# Altium schematic sheet BLE.SchDoc
size A4
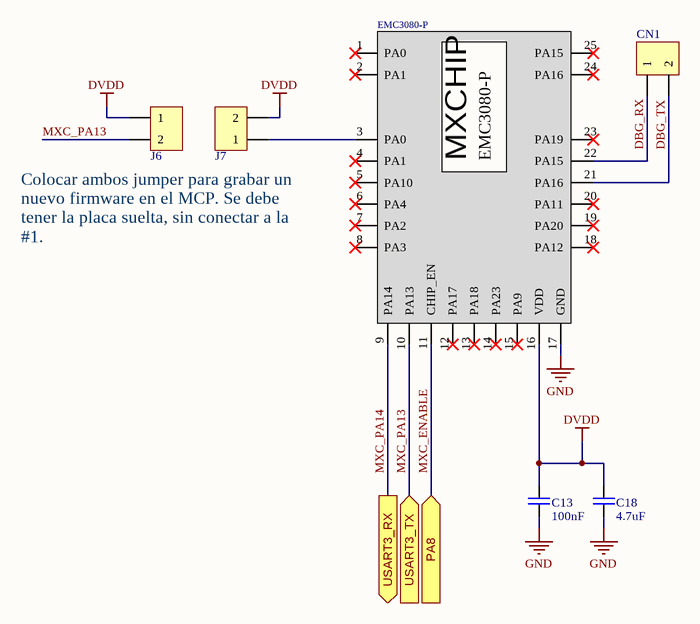
[diagram p0: BLE.SchDoc]

## Parts
C13  100nF  [CAP_SM0805_YAGEOCC2_N]
C18  4.7uF  [CAP_SM0805_YAGEOCC2_N]
CN1  Usar Equivalente  [HEADER PIN 1X2]  (value not drawn)
EMC3080-P  EMC3080-P  [EMC3080-P]  (value not drawn)
J6  Usar Equivalente  [HEADER PIN 1X2]  (value not drawn)
J7  Usar Equivalente  [HEADER PIN 1X2]  (value not drawn)

## Ports
PA8 (in), USART3_RX (out), USART3_TX (in)

## Nets
DVDD: C13.1 C18.1 EMC3080-P.16(VDD) J6.1 J7.2
GND: C13.2 C18.2 EMC3080-P.17(GND)
DBG_RX: CN1.1 EMC3080-P.22(PA15)
DBG_TX: CN1.2 EMC3080-P.21(PA16)
MXC_ENABLE: EMC3080-P.11(CHIP_EN) ; port PA8
MXC_PA13: EMC3080-P.10(PA13) J6.2 ; port USART3_TX
MXC_PA14: EMC3080-P.9(PA14) ; port USART3_RX
NetEMC3080-P_3: EMC3080-P.3(PA0) J7.1

Not connected (* = marked no-connect by the designer): EMC3080-P 1(PA0)* 2(PA1)* 4(PA1)* 5(PA10)* 6(PA4)* 7(PA2)* 8(PA3)* 12(PA17)* 13(PA18)* 14(PA23)* 15(PA9)* 18(PA12)* 19(PA20)* 20(PA11)* 23(PA19)* 24(PA16)* 25(PA15)*

## Notes on the sheet
- Colocar ambos jumper para grabar un nuevo firmware en el MCP. Se debe tener la placa suelta, sin conectar a la #1.
- Title:
- Size: A4
- Date:
- FMC-320U MODEL A
- Sheet:
- Time:
- Of:
- Version:
- Revision:
- Release:
- 1
- 0
- FLOWMEET SRL
- File

## Library data of the parts
C13 = CC0805KRX7R8BB104: CAP 100nF SM0805 X7R 25V YAGEO CC2; Tolerance (%): 10; Voltage Rating (Volts): 25; Category: Capacitor; Manufacturer: Yageo; Manufacturer Part Number: CC0805KRX7R8BB104; Package: 0805; Value: 100nF; Supplier Part Number 1: 644249; Supplier 1: Farnell; ComponentLink1URL: http://www.yageo.com; ComponentLink1Description: Manufacturer Website; Supplier 2: Digi-Key; Supplier Part Number 2: 311-1141-1-ND
C18 = CC0805KRX5R6BB475: CAP 4.7uF SM0805 X5R 10V YAGEO CC2; Tolerance (%): 10; Category: Capacitor; Manufacturer: Yageo; Manufacturer Part Number: CC0805KRX5R6BB475; Package: 0805; Value: 4.7uF; Supplier Part Number 1: 718671; Supplier 1: Farnell; ComponentLink1URL: http://www.yageo.com; ComponentLink1Description: Manufacturer Website; Voltage Rating (Volts): 10; Supplier 2: Digi-Key; Supplier Part Number 2: 311-1374-1-ND; Datasheet: https://datasheet.lcsc.com/lcsc/2304140030_YAGEO-CC0805KRX5R6BB475_C605218.pdf
CN1 J6 J7 = 54101-T0602LF: 1 x 2 - true hole  2.54mm - Pb free; Manufacturer: Amphenol ICC; Equivalente: B-2100S02P-A110; Manufacturer Part Number: 54101-T0602LF; Category: Header pin; Datasheet: https://datasheet.lcsc.com/lcsc/2202082130_Amphenol-ICC-54101-T06-00_C213463.pdf
EMC3080-P = EMC3080-P: Solamente es el zocalo donde va montado el chip, por eso no tiene modelo 3D; Manufacturer: MXCHIP; Manufacturer Part Number: EMC3080-P; Category: BLE Module; Datasheet: https://files.seeedstudio.com/products/113990975/EMC3080EN.pdf